# Altium project Racer.PrjPcb
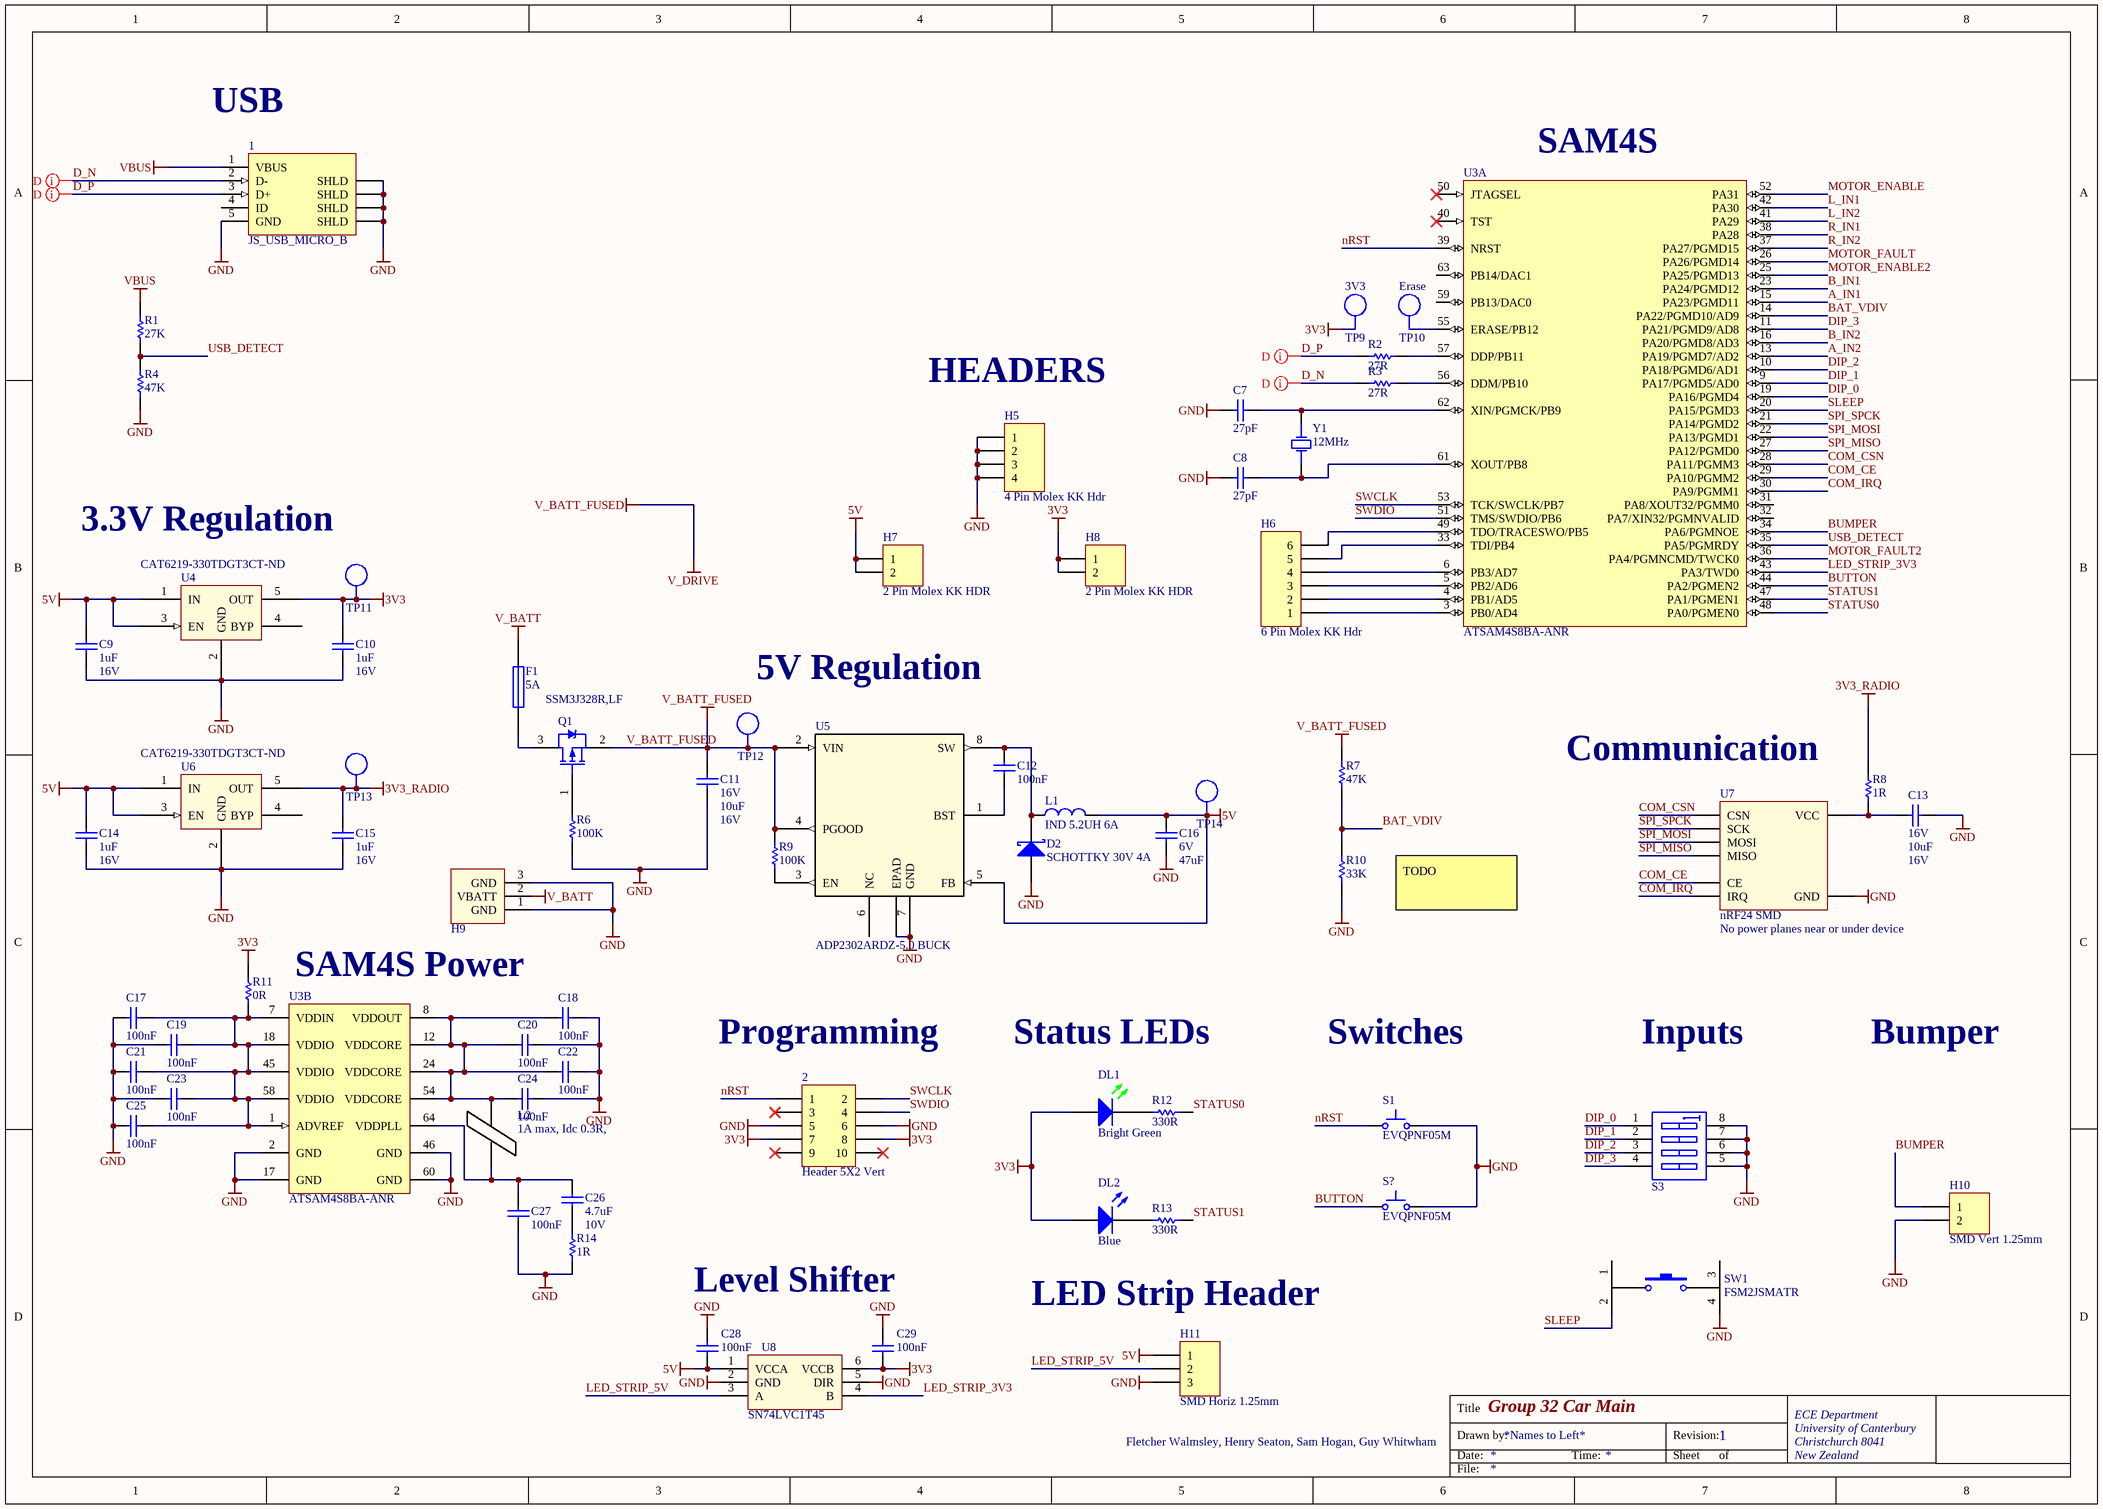
[diagram p0: Racer.SchDoc]
2 sheets, 89 parts. Net scope: global (net labels, ports and power ports of the same name join across sheets).
Board file: car_template 2021V3.PcbDoc
Sheets:
  Racer.SchDoc
  MotorDriver.SchDoc

## Sheet Racer.SchDoc: Group 32 Car Main
size A3; DrawnBy: *Names to Left*; Address1: ECE Department; Address2: University of Canterbury; Address3: Christchurch 8041; Address4: New Zealand; Revision: 1

### Parts
1  JS_USB_MICRO_B  [FCI_USB_10118194-0001LF]
2  Header 5X2 Vert  [IDC2.54-V10D]
C7  27pF  [CAPC1608L]
C8  27pF  [CAPC1608L]
C9  Max Voltage: 16V  [CAPC1608L]  (hidden comment: 1uF)
C10  Max Voltage: 16V  [CAPC1608L]  (hidden comment: 1uF)
C11  Voltage - Rated: 16V  [CAPC2012L]  (hidden comment: 10uF)
C12  100nF  [CAPC1608L]
C13  Voltage - Rated: 16V  [CAPC2012L]  (hidden comment: 10uF)
C14  Max Voltage: 16V  [CAPC1608L]  (hidden comment: 1uF)
C15  Max Voltage: 16V  [CAPC1608L]  (hidden comment: 1uF)
C16  Max Voltage: 6V  [CAPC3216L]  (hidden comment: 47uF)
C17  100nF  [CAPC1608L]
C18  100nF  [CAPC1608L]
C19  100nF  [CAPC1608L]
C20  100nF  [CAPC1608L]
C21  100nF  [CAPC1608L]
C22  100nF  [CAPC1608L]
C23  100nF  [CAPC1608L]
C24  100nF  [CAPC1608L]
C25  100nF  [CAPC1608L]
C26  Max Voltage: 10V  [CAPC1608N]  (hidden comment: 4.7uF)
C27  100nF  [CAPC1608L]
C28  100nF  [CAPC1608L]
C29  100nF  [CAPC1608L]
D2  SCHOTTKY 30V 4A  [SMC]
DL1  Bright Green  [WL-SMCW0603]
DL2  Blue  [WL-SMCW0603]
F1  5A  [RESC3216N]
H5  4 Pin Molex KK Hdr  [MOLEX_KK_4_HDR]
H6  6 Pin Molex KK Hdr  [MOLEX_KK_6_HDR]
H7  2 Pin Molex KK HDR  [MOLEX_KK_2_HDR]
H8  2 Pin Molex KK HDR  [MOLEX_KK_2_HDR]
H9  Battery_HEADER_3pin  [BATT_HEADER_3POS]  (value not drawn)
H10  SMD Vert 1.25mm  [SD-53398-0219]
H11  SMD Horiz 1.25mm  [SD-53261-0319]
L1  IND 5.2UH 6A  [INDUCTOR5u2]
L2  1A max, Idc 0.3R,  [INDC3216L]
Q1  SSM3J328R,LF  [SOT23_L]
R1  27K  [RESC1608L]
R2  27R  [RESC1608L]
R3  27R  [RESC1608L]
R4  47K  [RESC1608N]
R6  100K  [RESC1608L]
R7  47K  [RESC1608N]
R8  1R  [RESC3216L]
R9  100K  [RESC1608L]
R10  33K  [RESC1608L]
R11  0R  [RESC1608L]
R12  330R  [RESC1608L]
R13  330R  [RESC1608L]
R14  1R  [RESC3216L]
S1  EVQPNF05M  [EVQPNF05M]
S3  WS_SW DIP-4  [DIP_SW_4WAY_SMD -]  (value not drawn)
S?  EVQPNF05M  [EVQPNF05M]
SW1  FSM2JSMATR  [FSM2JSMA]
TP9  3V3  [TP_1206]  (no BOM)
TP10  Erase  [TP_1206]  (no BOM)
TP11  TP  [TP_1206]  (value not drawn)  (no BOM)
TP12  TP  [TP_1206]  (value not drawn)  (no BOM)
TP13  TP  [TP_1206]  (value not drawn)  (no BOM)
TP14  TP  [TP_1206]  (value not drawn)  (no BOM)
U3  ATSAM4S8BA-ANR  [LQFP64_L]  (parts A,B of 2)
U4  Supplier Part Number: CAT6219-330TDGT3CT-ND  [SOT95P280X145-5N]  (hidden comment: CAT6219-330TDGT3)
U5  ADP2302ARDZ-5.0 BUCK  [RD_8_1]
U6  Supplier Part Number: CAT6219-330TDGT3CT-ND  [SOT95P280X145-5N]  (hidden comment: CAT6219-330TDGT3)
U7  nRF24 SMD  Warning: No power planes near or under device  [NRF24]
U8  SN74LVC1T45  [SOT23-6_N]
Y1  12MHz  [6.0X3.5-4]

### Nets
3V3: 2.7 2.8 C10.2 C29.1 DL1.2(A) DL2.2(A) H8.1 H8.2 R11.2 TP9.1 TP11.1 U4.5(OUT) U8.6(VCCB)
3V3_RADIO: C15.2 R8.2 TP13.1 U6.5(OUT)
5V: C9.2 C14.2 C16.2 C28.1 H7.1 H7.2 H11.1 L1.2 TP14.1 U4.1(IN) U4.3(EN) U5.5(FB) U6.1(IN) U6.3(EN) U8.1(VCCA)
GND: 1.5(GND) 1.6(SHLD) 2.5 2.6 C7.1 C8.1 C9.1 C10.1 C11.1 C13.1 C14.1 C15.1 C16.1 C17.1 C18.2 C19.1 C20.2 C21.1 C22.2 C23.1 C24.2 C25.1 C27.1 C28.2 C29.2 D2.1(A) H5.1 H5.2 H5.3 H5.4 H9.1(GND) H9.3(GND) H10.2 H11.3 R4.1 R6.1 R10.2 R14.2 S1.2 S3.5(B4) S3.6(B3) S3.7(B2) S3.8(B1) S?.2 SW1.4 U3.2(GND) U3.17(GND) U3.46(GND) U3.60(GND) U4.2(GND) U5.7(GND) U5.EPAD U6.2(GND) U7.2(GND) U8.2(GND) U8.5(DIR)
V_BATT: F1.2 H9.2(VBATT)
V_BATT_FUSED: C11.2 Q1.2 R7.1 R9.2 TP12.1 U5.2(VIN) U5.4(PGOOD)  [also labelled V_DRIVE]
VBUS: 1.1(VBUS) R1.2
A_IN1: U3.15(PA23/PGMD11)
A_IN2: U3.13(PA19/PGMD7/AD2)
B_IN1: U3.23(PA24/PGMD12)
B_IN2: U3.16(PA20/PGMD8/AD3)
BAT_VDIV: R7.2 R10.1 U3.14(PA22/PGMD10/AD9)
BUMPER: H10.1 U3.34(PA6/PGMNOE)
BUTTON: S?.1 U3.44(PA2/PGMEN2)
COM_CE: U3.29(PA10/PGMM2) U7.3(CE)
COM_CSN: U3.28(PA11/PGMM3) U7.4(CSN)
COM_IRQ: U3.30(PA9/PGMM1) U7.8(IRQ)
D_N: 1.2(D-) R3.1
D_P: 1.3(D+) R2.1
DIP_0: S3.1(A1) U3.19(PA16/PGMD4)
DIP_1: S3.2(A2) U3.9(PA17/PGMD5/AD0)
DIP_2: S3.3(A3) U3.10(PA18/PGMD6/AD1)
DIP_3: S3.4(A4) U3.11(PA21/PGMD9/AD8)
L_IN1: U3.42(PA30)
L_IN2: U3.41(PA29)
LED_STRIP_3V3: U3.43(PA3/TWD0) U8.4(B)
LED_STRIP_5V: H11.2 U8.3(A)
MOTOR_ENABLE: U3.52(PA31)
MOTOR_ENABLE2: U3.25(PA25/PGMD13)
MOTOR_FAULT: U3.26(PA26/PGMD14)
MOTOR_FAULT2: U3.36(PA4/PGMNCMD/TWCK0)
nRST: 2.1 S1.1 U3.39(NRST)
R_IN1: U3.38(PA28)
R_IN2: U3.37(PA27/PGMD15)
SLEEP: SW1.2 U3.20(PA15/PGMD3)
SPI_MISO: U3.27(PA12/PGMD0) U7.7(MISO)
SPI_MOSI: U3.22(PA13/PGMD1) U7.6(MOSI)
SPI_SPCK: U3.21(PA14/PGMD2) U7.5(SCK)
STATUS0: R12.2 U3.48(PA0/PGMEN0)
STATUS1: R13.2 U3.47(PA1/PGMEN1)
SWCLK: 2.2 U3.53(TCK/SWCLK/PB7)
SWDIO: 2.4 U3.51(TMS/SWDIO/PB6)
USB_DETECT: R1.1 R4.2 U3.35(PA5/PGMRDY)
NetC7_2: C7.2 U3.62(XIN/PGMCK/PB9) Y1.3(OSC2)
NetC8_2: C8.2 U3.61(XOUT/PB8) Y1.1(OSC1)
NetC12_1: C12.1 U5.1(BST)
NetC12_2: C12.2 D2.2(K) L1.1 U5.8(SW)
NetC13_2: C13.2 R8.1 U7.1(VCC)
NetC17_2: C17.2 C19.2 C21.2 C23.2 C25.2 R11.1 U3.1(ADVREF) U3.7(VDDIN) U3.18(VDDIO) U3.45(VDDIO) U3.58(VDDIO)
NetC18_1: C18.1 C20.1 C22.1 C24.1 L2.2 U3.8(VDDOUT) U3.12(VDDCORE) U3.24(VDDCORE) U3.54(VDDCORE)
NetC26_1: C26.1 C27.2 L2.1 U3.64(VDDPLL)
NetC26_2: C26.2 R14.1
NetDL1_1: DL1.1(K) R12.1
NetDL2_1: DL2.1(K) R13.1
NetF1_1: F1.1 Q1.3
NetH6_1: H6.1 U3.3(PB0/AD4)
NetH6_2: H6.2 U3.4(PB1/AD5)
NetH6_3: H6.3 U3.5(PB2/AD6)
NetH6_4: H6.4 U3.6(PB3/AD7)
NetH6_5: H6.5 U3.33(TDI/PB4)
NetH6_6: H6.6 U3.49(TDO/TRACESWO/PB5)
NetQ1_1: Q1.1 R6.2
NetR2_2: R2.2 U3.57(DDP/PB11)
NetR3_2: R3.2 U3.56(DDM/PB10)
NetR9_1: R9.1 U5.3(EN)
NetTP10_1: TP10.1 U3.55(ERASE/PB12)

Not connected (* = marked no-connect by the designer): 1 4(ID); 2 3* 9* 10*; SW1 1 3; U3 31(PA8/XOUT32/PGMM0) 32(PA7/XIN32/PGMNVALID) 40(TST)* 50(JTAGSEL)* 59(PB13/DAC0) 63(PB14/DAC1); U4 4(BYP); U5 6(NC); U6 4(BYP)

### Layout directives
differential pair: D_N, D_P

### Notes on the sheet
- (near 1) USB
- (near U3) SAM4S
- (near H5) HEADERS
- 3.3V Regulation
- 5V Regulation
- Communication
- TODO
- SAM4S Power
- (near 2) Programming
- Status LEDs
- Switches
- Inputs
- Bumper
- Level Shifter
- LED Strip Header
- Fletcher Walmsley, Henry Seaton, Sam Hogan, Guy Whitwham
- Title
- Drawn by:
- Date:
- Time:
- Revision:
- Sheet
- of
- File:

### Library data of the parts
1 = JS_USB_MICRO_B_SMT: CONN USB MICRO B RECPT SMT R/A; Manufacturer: FCI; Manufacturer Part Number: 10118194-0001LF; Gender: Receptacle; Number of Contacts: 5; Specifications: USB 2.0; Supplier 1: Digi-Key; Supplier Part Number 1: 609-4618-1-ND; Features: Shielded, Solder Retention; Mounting Type: Surface Mount, Right Angle, Horizontal
2 = JA_HDR_IDC_5X2_VERT: IDC Header, 2,54mm, 10-Pin, Vert; Supplier: ECE Dept; Supplier 1: Farnell; Supplier Part Number 1: 1096985; Storage Location: ECE Dept Store
C7 C8 = CC_27pF_0603: CAP CER 27pF NPO/COG +-5% 50V 0603; PackageReference: 0603; Code_IPC: 1608 [0603]; Verify: *; Supplier: ECE Dept; Storage Location: PCB Assembly WS; Value: 27pF
C9 C10 C14 C15 = CC_1uF_0603: CAP CER 1uF Y5V -20% +80% 16V 0603; PackageReference: 0603; Code_IPC: 1608 [0603]; Verify: *; Supplier: ECE Dept; Storage Location: PCB Assembly WS; Value: 1uF
C11 C13 = CC_10uF_16V_0805: CAP CER 10uF X5R 16V 0805; Manufacturer: Samsung Electro-Mechanics; Manufacturer Part Number: CL21A106KOQNNWE; Note: Footprint corresponds to dimensions for bulk cassette packaging. This case size has tightened tolerances.; Tolerance: ±10%; Notification: Current market demand for these product types have resulted in fluctuating and extending lead times. Lead times may differ.; PackageReference: 0805; Code_IPC: 2012[0805]; Supplier 1: Digi-Key; RoHS: RoHS Compliant; Category: Capacitors; Stock 1: 20000; Pricing 1: 1=0.35, 10=0.25, 100=0.1178, 500=0.08254, 1000=0.06831 (NZD); Packaging: Cut Tape (CT); Part Status: Active; Temperature Coefficient: X5R; Operating Temperature: -55°C ~ 85°C; Features: -; Ratings: -; Applications: General Purpose; Mounting Type: Surface Mount, MLCC; Package / Case: 0805 (2012 Metric); Size / Dimension: 0.079" L x 0.049" W (2.00mm x 1.25mm); Height - Seated (Max): -; Thickness (Max): 0.055" (1.40mm); Lead Spacing: -; Lead Style: -; ComponentLink1URL: http://www.samsungsem.com/kr/support/product-search/mlcc/CL21A106KOQNNWE.jsp; ComponentLink1Description: http://www.samsungsem.com/kr/support/product-search/mlcc/CL21A106KOQNNWE.jsp; Supplier Part Number 1: 1276-2894-1-ND; Value: 10uF; Max Voltage: 16V
C12 C17-C25 C27-C29 = CC_100nF_0603: CAP CER 100nF X7R +-10% 50V 0603; PackageReference: 0603; Code_IPC: 1608 [0603]; Verify: *; Supplier: ECE Dept; Storage Location: PCB Assembly WS; Value: 100nF
C16 = CC_47uF_1206: CAP CER 47uF X5R -/+20% 6V 1206; Verify: *; Supplier: ECE Dept; Storage Location: PCB Assembly WS; Dielectric: X5R; Footprint: 1210 (3225 metric); MoV: 6V; Value: 47uF
C26 = CC_4.7uF_0603: CAP CER 4.7uF X5R +-20%  10V 0603; Note: Footprint corresponds to dimensions for bulk cassette packaging. This case size has tightened tolerances.; PackageReference: 0805; Code_IPC: 2012[0805]; Verify: *; Supplier: ECE Dept; Storage Location: PCB Assembly WS; Value: 4.7uF
D2 = MBRS330T3G: DIODE SCHOTTKY 30V 4A SMC; Manufacturer: ON Semiconductor; Speed: Fast Recovery =< 500ns, > 200mA (Io); Supplier 1: Digi-Key; Manufacturer Part Number: MBRS330T3G; RoHS: RoHS Compliant; Category: Discrete Semiconductor Products; Stock 1: 8919; Pricing 1: 1=0.93, 10=0.79, 100=0.5902, 500=0.46368, 1000=0.35829 (NZD); Packaging: Cut Tape (CT); Part Status: Active; Diode Type: Schottky; Current - Average Rectified (Io): 4A; Capacitance @ Vr, F: -; Mounting Type: Surface Mount; Package / Case: DO-214AB, SMC; Supplier Device Package: SMC; Operating Temperature - Junction: -65°C ~ 150°C; Base Part Number: MBRS330; ComponentLink1URL: http://www.onsemi.com/pub/Collateral/MBRS340T3-D.PDF; ComponentLink1Description: http://www.onsemi.com/pub/Collateral/MBRS340T3-D.PDF; Supplier Part Number 1: MBRS330T3GOSCT-ND
DL1 = DL_150060VS75000: LED Bright Green 40mcd 0603 SMD; Manufacturer: WURTH ELEKTRONIK; Forward Current If: 30; Forward Voltage: 2; Viewing Angle: 140°; Wavelength Typ: 570; Luminous Intensity: 40; LED Mounting: SMD; Supplier 1: Farnell; Supplier Part Number 1: 2322073; Manufacturer Part Number: 150060VS75000; Storage Location: PCB Assembly WS; Supplier: ECE Dept; LED Colour: Bright Green
DL2 = DL_150060BS75000: LED Blue 270mcd 0603 SMD; Manufacturer: WURTH ELEKTRONIK; Forward Current If: 30; Forward Voltage: 3.2; Luminous Intensity: 270; Viewing Angle: 120°; Wavelength Typ: 470; Pricing: 1=0.3844, 50=0.3252, 100=0.2957, 500=0.2365 (NZD); Supplier 1: Farnell; Supplier Part Number 1: 2322069; Manufacturer Part Number: 150060BS75000; Storage Location: PCB Assembly WS; Supplier: ECE Dept; LED Colour: Blue
F1 = FS_Fuse_5.0A: Fuse 5.0A Fast Acting 1206 SMD; Manufacturer Part Number: C1F5; Manufacturer: Bel TRP; Voltage Rating (AC): 125V; Voltage Rating (DC): 63V; DC Cold Resistance: 19mR; Fuse Type: Board Mount (Cartridge Style Excluded); Approvals: CE,cURus; Mount: Surface Mount; Case/Package: 1206; Number of Pins: 2; Case Code (Metric): 3216; Case Code (Imperial): 1206; Contact Plating: Nickel,Tin; Min Operating Temperature: -55°C; Max Operating Temperature: 125°C; Packaging: Tape and Reel; Voltage Rating: 125V; Length: 0.126inch; Width: 0.062inch; Supplier 1: Digi-Key; Stock 1: 725; Pricing 1: 1=0.32, 5=0.312, 10=0.298, 50=0.2662, 100=0.2479, 250=0.22032, 500=0.1836, 1000=0.17442 (USD); ComponentLink1URL: http://www.farnell.com/datasheets/2571625.pdf; ComponentLink1Description: http://www.farnell.com/datasheets/2571625.pdf; ComponentLink2URL: http://belfuse.com/pdfs/C1F.pdf; ComponentLink2Description: http://belfuse.com/pdfs/C1F.pdf; ComponentLink3URL: http://www.mouser.com/ds/2/643/C1F-594910.pdf; ComponentLink3Description: http://www.mouser.com/ds/2/643/C1F-594910.pdf; ComponentLink4URL: https://belfuse.com/resources/StewartConnector/C1F.pdf; ComponentLink4Description: https://belfuse.com/resources/StewartConnector/C1F.pdf; Current Rating: 5A; Supplier Part Number 1: 507-1886-1-ND; Supplier 2: Element14; Supplier Part Number 2: 2848595; Value: 5A
H5 = JA_MOLEX_KK_4POS: CONN HEADER 4POS 2.54mm VERT_Thru Hole; Manufacturer: Molex; Manufacturer PN: 22-23-2041; Supplier Part Number 1: 9731164; Supplier: ECE Dept; Supplier 1: Farnell; Storage Location: ECE Dept Store; Value: 4 Pin Molex KK Hdr
H6 = JA_MOLEX_KK_6POS: CONN HEADER 6POS 2.54mm VERT_Thru Hole; Supplier Part Number 1: 1462922; Supplier: ECE Dept; Supplier 1: Farnell; Storage Location: ECE Dept Store; Value: 6 Pin Molex KK Hdr
H7 H8 = JA_MOLEX_KK_2POS: CONN HEADER 2POS 2.54mm VERT_Thru Hole; Supplier 1: Farnell; Supplier Part Number 1: 1462926; Supplier: ECE Dept; Storage Location: ECE Dept Store; Value: 2 Pin Molex KK HDR
H9 = Battery_HEADER_3pin: 3Pin Header 2.54mm spacing
H10 = JB_53398-02: Header_Vert_2Pos_1.25mm_125V@1A_SMT; Manufacturer: Molex Inc; Manufacturer Part Number: 0533980271; Number of Positions: 2; Pitch: 0.049" (1.25mm); Contact Type: Blade Pin; Mounting Type: Surface Mount; Supplier 1: Digi-Key; Supplier Part Number 1: WM7606CT-ND; Supplier: ECE Dept; Storage Location: PCB Assembly WS; Value: SMD Vert 1.25mm
H11 = JB_53261-03: Header_Horiz_3Pos_1.25mm_125V@1A_SMT; Manufacturer: Molex; Manufacturer Part Number: 53261-0390; Number of Positions: 3; Pitch: 0.049" (1.25mm); Contact Type: Blade Pin; Mounting Type: Surface Mount, Right Angle; Supplier 1: Farnell; Supplier Part Number 1: 1125359; Supplier 2: Digi-Key; Supplier Part Number 2: WM1754CT-ND; Supplier: ECE Dept; Storage Location: PCB Assembly WS; Value: SMD Horiz 1.25mm
L1 = CDRH104RNP-5R2NC: FIXED IND 5.2UH 6A 22 MOHM SMD; Manufacturer: Sumida America Components Inc.; Material - Core: Ferrite; Tolerance: ±30%; Current - Saturation: 5.6A; Shielding: Shielded; DC Resistance (DCR): 22 mOhm Max; Supplier 1: Digi-Key; Manufacturer Part Number: CDRH104RNP-5R2NC; RoHS: RoHS Compliant; Category: Inductors, Coils, Chokes; Stock 1: 3849; Pricing 1: 1=2.9, 10=2.678, 100=1.8743, 500=1.5173 (NZD); Packaging: Cut Tape (CT); Part Status: Active; Type: -; Q @ Freq: -; Frequency - Self Resonant: -; Ratings: -; Operating Temperature: -40°C ~ 100°C; Mounting Type: Surface Mount; Package / Case: Nonstandard; Supplier Device Package: -; Size / Dimension: 0.402" L x 0.394" W (10.20mm x 10.00mm); Height - Seated (Max): 0.157" (4.00mm); ComponentLink1URL: http://products.sumida.com/products/pdf/CDRH104R.pdf; ComponentLink1Description: http://products.sumida.com/products/pdf/CDRH104R.pdf; Supplier Part Number 1: 308-2280-1-ND
L2 = IN_Ferrite-Bead: Ferrite Bead, Rdc 0.3R, Z100MHZ 600R, Imax 1A, SMD 1206; Manufacturer: FAIR-RITE; Manufacturer PN: 2512066017Y1; DC Current Rating: 1; DC Resistance Max: 0.08; Ferrite Case Style: 1206 ^3216 Metric]; Frequency Range: 50MHz to 1; Impedance: 600; Impedance Tolerance: ± 25%; Supplier: ECE Dept; Storage Location: PCB Assembly WS; Ferrite Mounting: SMD; Supplier 1: Farnell; Supplier Part Number 1: 1612060; Manufacturer Part Number: 2512066017Y1; Value: 1A max, Idc 0.3R,
Q1 = TM_SSM3J328R: MOSFET P-CH 20V 6A SOT23-3; Manufacturer: Toshiba; FET Feature: Logic Level Gate, 1.5V Drive; FET Type: MOSFET P-Channel, Metal Oxide; Gate Charge (Qg) @ Vgs: 12.8nC @ 4.5V; Input Capacitance (Ciss) @ Vds: 840pF @ 10V; Power - Max: 1W; Rds On Max: 29.8mR; Drain to Source Resistance: 47.4mR; Turn-On Delay Time: 32ns; Power Dissipation: 2W; Number of Channels: 1; Turn-Off Delay Time: 107ns; Gate to Source Voltage (Vgs): 8V; Input Capacitance: 840pF; Element Configuration: Single; Drain to Source Breakdown Voltage: -20V; Vgs(th) (Max) @ Id: 1V @ 1mA; Current - Continuous Drain (Id) @ 25° C: 6A; Drain to Source Voltage (Vdss): 20V; Package / Case: SOT-23-3 Flat Leads; Supplier Device Package: SOT-23F; Pricing: 1=0.79, 10=0.658, 25=0.5772, 100=0.4939, 250=0.42836, 500=0.36284, 1000=0.27972 (NZD); Storage Location: PCB Assembly WS; Supplier: Digi-Key; ComponentLink1URL: https://datasheet.ciiva.com/11158/ssm3j328r-datasheet-en-20140301-11158652.pdf; ComponentLink1Description: https://datasheet.ciiva.com/11158/ssm3j328r-datasheet-en-20140301-11158652.pdf; Supplier Part Number: SSM3J328RLFDKR-ND; Max Operating Temperature: 150°C; Mount: Surface Mount; Packaging: Tape and Reel; Min Operating Temperature: -55°C; Continuous Drain Current (ID): 6A; Radiation Hardening: No; Max Power Dissipation: 1W; Package Quantity: 3000; Case/Package: SOT-23-3; Number of Pins: 3; Number of Elements: 1; Supplier 1: Digi-Key; Supplier Part Number 1: SSM3J328RLFDKR-ND; Manufacturer Part Number: SSM3J328R,LF
R1 = RS_27K: RES 27K OHM 1/10W 5% 0603 SMD; Storage Location: PCB Assembly WS; Supplier: ECE Dept; Value: 27K
R2 R3 = RS_27R: RES 27 OHM 1/10W 5% 0603 SMD; Storage Location: PCB Assembly WS; Supplier: ECE Dept; Value: 27R
R4 R7 = RS_47K: RES 47.0K OHM 1/10W 5% 0603 SMD; Storage Location: PCB Assembly WS; Supplier: ECE Dept; Value: 47K
R6 R9 = RS_100K: RES 100K OHM 1/10W 5% 0603 SMD; Storage Location: PCB Assembly WS; Supplier: ECE Dept; Value: 100K
R8 R14 = RT_1R: RES 1R OHM 1/4W 5% 1206 SMD; Storage Location: PCB Assembly WS; Supplier: ECE Dept; Value: 1R
R10 = RS_33K: RES 33.0K OHM 1/10W 5% 0603 SMD; Storage Location: PCB Assembly WS; Supplier: ECE Dept; Value: 33K
R11 = RS_0R0: RES 0.0 OHM 1/10W 5% 0603 SMD; Storage Location: PCB Assembly WS; Supplier: ECE Dept; Value: 0R
R12 R13 = RS_330R: RES 330 OHM 1/10W 5% 0603 SMD; Storage Location: PCB Assembly WS; Supplier: ECE Dept; Value: 330R
S1 S? = WS_EVQPNF05M: Panasonic 6 x 3.5mm SMD Light Touch Switch Type SMD; PackageDescription: 6.0 x 3.5 mm; Supplier 1: Farnell; Supplier Part Number 1: 2079481; Manufacturer: Panasonic; Manufacturer PN: EVQPNF05M; Supplier 2: Digi-Key; Supplier Part Number 2: P13598SCT-ND; Storage Location: PCB Assembly WS; Supplier: ECE Dept
S3 = WS_SW DIP-4: DIP Switch, 4 Position, SPST SMD; Manufacturer: OMRON ELECTRONIC COMPONENTS; Manufacturer Part Number: A6SN-4101; Contact Current DC Max: 25; External Length / Height: 12.1; No. of Switch Positions: 4; Pitch Spacing: 2.54; Contact Configuration: SPST; Supplier 1: Farnell; Supplier Part Number 1: 2029425; Storage Location: PCB Assembly WS; Supplier: ECE Dept
SW1 = WS_FSM2JSMATR: SWITCH TACTILE SPST-NO 0.05A 12V SMD; Manufacturer: TE Connectivity; Actuator Height off PCB, from Pins: 4.30mm; Actuator Orientation: Top Actuated; Contact Rating @ Voltage: 0.05A @ 12VDC; Operating Force: 160gf; Outline: 6.00mm x 6.00mm; Supplier 1: Farnell; Supplier 2: Digi-Key; Circuit: SPST-NO; Pricing: 1=0.55, 10=0.518, 25=0.4444, 50=0.3778, 100=0.363, 250=0.32592, 500=0.31108 (NZD); Supplier Part Number 1: 1570392; Supplier Part Number 2: 450-1757-1-ND; Storage Location: PCB Assembly WS; Supplier: ECE Dept; Manufacturer Part Number: FSM2JSMATR
TP9 TP10 = TP_1206: Test-Point 3.3x1.6x2.1mm SMD; Manufacturer: Harwin Inc; Manufacturer Part Number: S1751-46R; Value: TP; Manufacturer PN: *; Storage Location: ProtoPlace; Mounting Type: Surface Mount; Type: PC Test Point; Supplier 1: Digi-Key; Supplier Part Number 1: 952-1478-2-ND; Supplier 2: Farnell; Supplier Part Number 2: 1826282; Supplier: ECE Dept
TP11-TP14 = TP_1206: Test-Point 3.3x1.6x2.1mm SMD; Manufacturer: Harwin Inc; Manufacturer Part Number: S1751-46R; Manufacturer PN: *; Storage Location: ProtoPlace; Mounting Type: Surface Mount; Type: PC Test Point; Supplier 1: Digi-Key; Supplier Part Number 1: 952-1478-2-ND; Supplier 2: Farnell; Supplier Part Number 2: 1826282; Supplier: ECE Dept; Value: TP
U3 = SE_ATSAM4S16BA-MU: IC MCU 32BIT 512KB FLASH 64LQFP; Manufacturer: Atmel; Connectivity: I²C, IrDA, Memory Card, SPI, SSC, UART/USART, USB; Core Processor: ARM® Cortex®-M4; Core Size: 32-Bit; Data Converters: A/D 11x12b, D/A 2x12b; Number of I/O: 47; Peripherals: Brown-out Detect/Reset, DMA, POR, PWM, WDT; Program Memory Size: 512KB (512K x 8); RAM Size: 128K x 8; Speed: 120MHz; Voltage - Supply (Vcc/Vdd): 1.62 V ~ 3.6 V; PackageVersion: revJ, Jul-2007; PackageReference: 64PS; PackageDescription: 64-Pin Quad Flat No-Lead (QFN) Sawn, 9 x 9 x 1.0 mm Body, 0.5 mm Pitch, Exposed Pad; Code_JEDEC: MO-220VMMD-3; ComponentLink1Description: Manufacturer URL; ComponentLink1URL: http://www.atmel.com/; ComponentLink2Description: SAM4S Series Datasheet; ComponentLink2URL: http://www.atmel.com/dyn/resources/prod_documents/11100.pdf; ComponentLink3Description: SAM4S Series Summary; ComponentLink3URL: http://www.atmel.com/dyn/resources/prod_documents/11100S.pdf; Supplier 1: Digi-Key; Package / Case: 64-LQFP; Packaging: Cut Tape (CT); Program Memory Type: FLASH; Supplier Part Number 1: ATSAM4S8BA-ANRCT-ND; Manufacturer Part Number: ATSAM4S8BA-ANR
U4 U6 = SV_CAT6219-330TDGT3: IC REG LIN 3.3V 500MA TSOT23-5; Voltage - Input (Max): 5.5V; Voltage Dropout (Max): 0.5V @ 500mA; Manufacturer Part Number: CAT6219-330TDGT3; Base Part Number: CAT6219; Current - Output: 500mA; Package / Case: SOT-23-5 Thin, TSOT-23-5; Supplier: Digi-Key; Supplier Device Package: TSOT-23-5; Voltage - Output (Min/Fixed): 3.3V; ComponentLink1URL: http://www.onsemi.com/pub/Collateral/CAT6219-D.PDF; ComponentLink1Description: http://www.onsemi.com/pub/Collateral/CAT6219-D.PDF; Supplier 1: Digi-Key
U5 = ADP2302ARDZ-5.0-R7: IC REG BUCK 5V 2A 8SOIC; Vendor: Analog Devices Inc; Frequency - Switching: 700kHz; Output Type: Fixed; Voltage - Input (Max): 20V; Manufacturer_Part_Number: ADP2302ARDZ-5.0-R7; Type: DEV; Value: Value; Supplier 1: Digi-Key; Current - Output: 2A; Voltage - Output (Min/Fixed): 5V; Supplier Part Number 1: ADP2302ARDZ-5.0-R7CT-ND
U7 = NRF24: nRF24 SMD Module
U8 = SN74LVC1T45: 1.8V - 5V level converter
Y1 = XT_CRYSTAL_12MHz_18pF: CRYSTAL 12MHZ 18PF 6X3.5mm SMD; Manufacturer: CTS-Frequency Controls; Manufacturer Part Number: 406C35D12M00000; ESR (Equivalent Series Resistance): 60 Ohm; Frequency Stability: ±50ppm; Frequency Tolerance: ±30ppm; Operating Mode: Fundamental; Supplier 1: Digi-Key; Height: 0.047" (1.20mm); Load Capacitance: 18pF; Mounting Type: Surface Mount; Operating Temperature: -20°C ~ 70°C; Package / Case: 4-SMD, No Lead (DFN, LCC); Size / Dimension: 0.236" L x 0.138" W (6.00mm x 3.50mm); Supplier Part Number 1: CTX855CT-ND; Frequency: 12MHz

## Sheet MotorDriver.SchDoc: Group 32 Car Motor Drivers
size A4
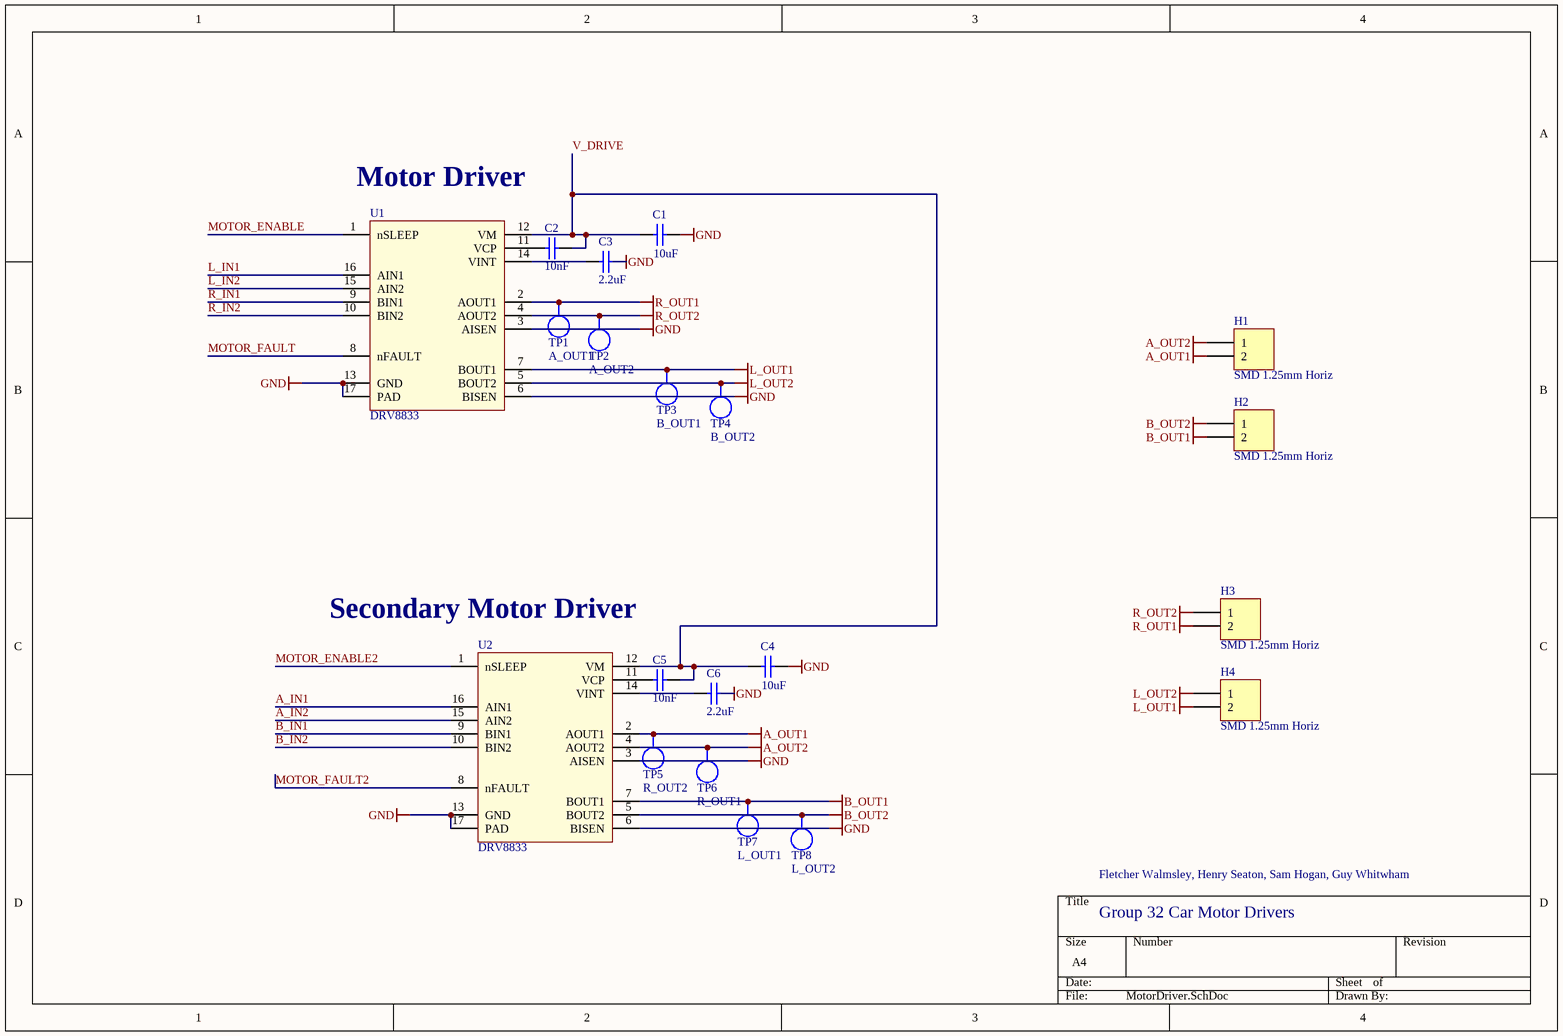
[diagram p1: MotorDriver.SchDoc]

### Parts
C1  10uF  [CAPC2012L]
C2  10nF  [CAPC1608L]
C3  2.2uF  [CAPC1608L]
C4  10uF  [CAPC2012L]
C5  10nF  [CAPC1608L]
C6  2.2uF  [CAPC1608L]
H1  SMD 1.25mm Horiz  [SD-53261-0219]
H2  SMD 1.25mm Horiz  [SD-53261-0219]
H3  SMD 1.25mm Horiz  [SD-53261-0219]
H4  SMD 1.25mm Horiz  [SD-53261-0219]
TP1  A_OUT1  [TP_1206]  (no BOM)
TP2  A_OUT2  [TP_1206]  (no BOM)
TP3  B_OUT1  [TP_1206]  (no BOM)
TP4  B_OUT2  [TP_1206]  (no BOM)
TP5  R_OUT2  [TP_1206]  (no BOM)
TP6  R_OUT1  [TP_1206]  (no BOM)
TP7  L_OUT1  [TP_1206]  (no BOM)
TP8  L_OUT2  [TP_1206]  (no BOM)
U1  DRV8833  [HTSOP16]
U2  DRV8833  [HTSOP16]

### Nets
A_OUT1: H1.2 TP5.1 U2.2(AOUT1)
A_OUT2: H1.1 TP6.1 U2.4(AOUT2)
B_OUT1: H2.2 TP7.1 U2.7(BOUT1)
B_OUT2: H2.1 TP8.1 U2.5(BOUT2)
GND: C1.1 C3.1 C4.1 C6.1 U1.3(AISEN) U1.6(BISEN) U1.13(GND) U1.17(PAD) U2.3(AISEN) U2.6(BISEN) U2.13(GND) U2.17(PAD)
L_OUT1: H4.2 TP3.1 U1.7(BOUT1)
L_OUT2: H4.1 TP4.1 U1.5(BOUT2)
R_OUT1: H3.2 TP1.1 U1.2(AOUT1)
R_OUT2: H3.1 TP2.1 U1.4(AOUT2)
V_DRIVE: C1.2 C2.2 C4.2 C5.2 U1.12(VM) U2.12(VM)  [project net V_BATT_FUSED]
A_IN1: U2.16(AIN1)
A_IN2: U2.15(AIN2)
B_IN1: U2.9(BIN1)
B_IN2: U2.10(BIN2)
L_IN1: U1.16(AIN1)
L_IN2: U1.15(AIN2)
MOTOR_ENABLE: U1.1(nSLEEP)
MOTOR_ENABLE2: U2.1(nSLEEP)
MOTOR_FAULT: U1.8(nFAULT)
MOTOR_FAULT2: U2.8(nFAULT)
R_IN1: U1.9(BIN1)
R_IN2: U1.10(BIN2)
NetC2_1: C2.1 U1.11(VCP)
NetC3_2: C3.2 U1.14(VINT)
NetC5_1: C5.1 U2.11(VCP)
NetC6_2: C6.2 U2.14(VINT)

### Notes on the sheet
- Motor Driver
- Secondary Motor Driver
- Fletcher Walmsley, Henry Seaton, Sam Hogan, Guy Whitwham
- Group 32 Car Motor Drivers

### Library data of the parts
C1 C4 = CC_10uF_16V_0805: as C11 on sheet Racer; PackageReference: 0805; Code_IPC: 2012[0805]; Supplier 1: Digi-Key; RoHS: RoHS Compliant; Category: Capacitors; Stock 1: 20000; Pricing 1: 1=0.35, 10=0.25, 100=0.1178, 500=0.08254, 1000=0.06831 (NZD); Packaging: Cut Tape (CT); Part Status: Active; Temperature Coefficient: X5R; Operating Temperature: -55°C ~ 85°C; Features: -; Ratings: -; Applications: General Purpose; Mounting Type: Surface Mount, MLCC; Package / Case: 0805 (2012 Metric); Size / Dimension: 0.079" L x 0.049" W (2.00mm x 1.25mm); Height - Seated (Max): -; Thickness (Max): 0.055" (1.40mm); Lead Spacing: -; Lead Style: -; ComponentLink1URL: http://www.samsungsem.com/kr/support/product-search/mlcc/CL21A106KOQNNWE.jsp; ComponentLink1Description: http://www.samsungsem.com/kr/support/product-search/mlcc/CL21A106KOQNNWE.jsp; Supplier Part Number 1: 1276-2894-1-ND; Value: 10uF
C2 C5 = CC_10nF_0603: CAP CER 10nF X7R +-10% 50V 0603; PackageReference: 0603; Code_IPC: 1608 [0603]; Verify: *; Supplier: ECE Dept; Storage Location: PCB Assembly WS; Value: 10nF
C3 C6 = CC_2.2uF_0603: CAP CER 2.2uF X5R +-20% 10V 0603; PackageReference: 0603; Code_IPC: 1608 [0603]; Verify: *; Supplier: ECE Dept; Storage Location: PCB Assembly WS; Value: 2.2uF
H1-H4 = JB_53261-02: Header_Horiz_2Pos_1.25mm_125V@1A_SMT; Manufacturer: MOLEX; Manufacturer Part Number: 53261-0271; External Depth: 4.2; External Length / Height: 3.4; Gender: Header; No. of Contacts: 2; Pitch Spacing: 1.25; Voltage Rating V AC: 125; Contact Termination: Surface Mount Right Angle; Lead Spacing: 1.25; Series: PicoBlade; Pricing: 5=0.27, 100=0.255, 250=0.245, 500=0.225, 1000=0.205 (NZD); Supplier 1: Farnell; Supplier Part Number 1: 1125373; Supplier 2: Digi-Key; Supplier Part Number 2: WM7620CT-ND; Supplier: ECE Dept; Storage Location: PCB Assembly WS; Value: SMD 1.25mm Horiz
TP1-TP8 = TP_1206: as TP9 on sheet Racer; Manufacturer PN: *; Storage Location: ProtoPlace; Mounting Type: Surface Mount; Type: PC Test Point; Supplier 1: Digi-Key; Supplier Part Number 1: 952-1478-2-ND; Supplier 2: Farnell; Supplier Part Number 2: 1826282; Supplier: ECE Dept
U1 U2 = DRV8833: Dual H-Bridge Motor Driver 1.5A

## Nets that join several sheets
GND: Racer (56 pins), MotorDriver (12 pins)
V_BATT_FUSED: Racer (7 pins), MotorDriver (6 pins)
A_IN1: Racer (U3.15), MotorDriver (U2.16)
A_IN2: Racer (U3.13), MotorDriver (U2.15)
B_IN1: Racer (U3.23), MotorDriver (U2.9)
B_IN2: Racer (U3.16), MotorDriver (U2.10)
L_IN1: Racer (U3.42), MotorDriver (U1.16)
L_IN2: Racer (U3.41), MotorDriver (U1.15)
MOTOR_ENABLE: Racer (U3.52), MotorDriver (U1.1)
MOTOR_ENABLE2: Racer (U3.25), MotorDriver (U2.1)
MOTOR_FAULT: Racer (U3.26), MotorDriver (U1.8)
MOTOR_FAULT2: Racer (U3.36), MotorDriver (U2.8)
R_IN1: Racer (U3.38), MotorDriver (U1.9)
R_IN2: Racer (U3.37), MotorDriver (U1.10)